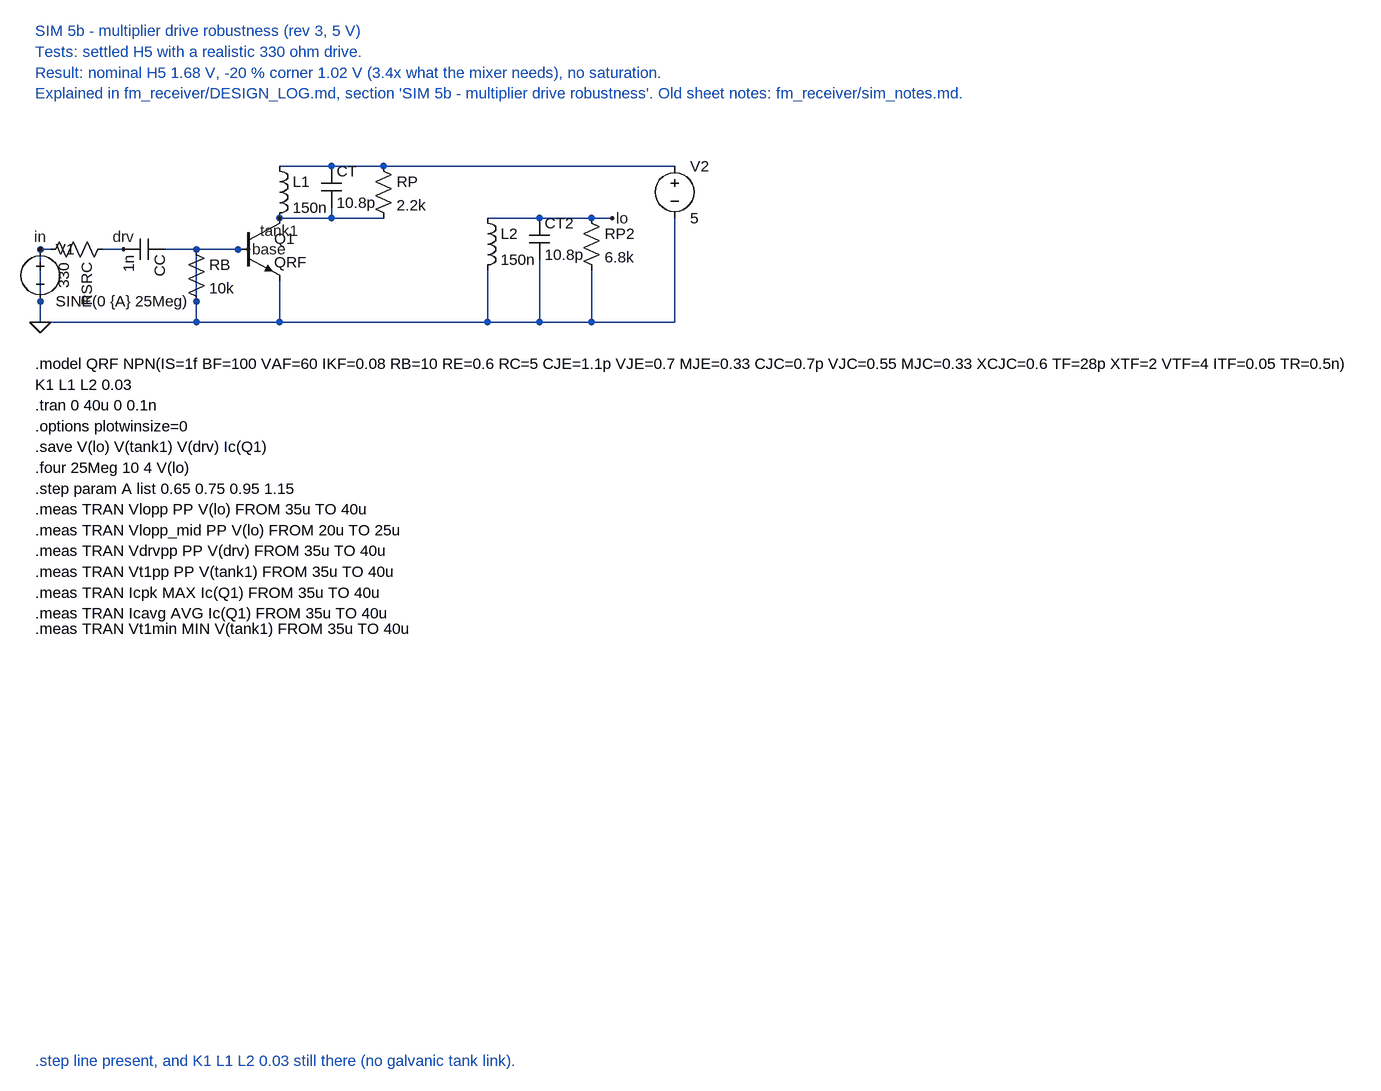
[diagram p0: schematic sim5b_multiplier_drive.asc]
sim5b_multiplier_drive.asc, the LTspice schematic file:
Version 4
SHEET 1 1400 780
WIRE 96 144 80 144
WIRE 208 144 176 144
WIRE 400 144 272 144
WIRE 320 224 320 144
WIRE 80 224 80 144
WIRE 528 16 448 16
WIRE 608 16 528 16
WIRE 1056 16 608 16
WIRE 528 96 448 96
WIRE 608 96 528 96
WIRE 528 96 528 80
WIRE 848 96 768 96
WIRE 928 96 848 96
WIRE 960 96 928 96
WIRE 448 256 448 192
WIRE 320 256 320 224
WIRE 80 256 80 224
WIRE 320 256 80 256
WIRE 448 256 320 256
WIRE 768 256 768 176
WIRE 768 256 448 256
WIRE 848 256 848 160
WIRE 848 256 768 256
WIRE 928 256 928 176
WIRE 928 256 848 256
WIRE 1056 256 928 256
WIRE 1056 256 1056 96
FLAG 80 256 0
FLAG 80 144 in
FLAG 208 144 drv
FLAG 400 144 base
FLAG 448 96 tank1
FLAG 960 96 lo
SYMBOL voltage 80 128 R0
SYMATTR InstName V1
SYMATTR Value SINE(0 {A} 25Meg)
SYMBOL res 192 128 R90
SYMATTR InstName RSRC
SYMATTR Value 330
SYMBOL cap 272 128 R90
SYMATTR InstName CC
SYMATTR Value 1n
SYMBOL res 304 128 R0
SYMATTR InstName RB
SYMATTR Value 10k
SYMBOL npn 384 96 R0
SYMATTR InstName Q1
SYMATTR Value QRF
SYMBOL ind 432 0 R0
SYMATTR InstName L1
SYMATTR Value 150n
SYMBOL cap 512 16 R0
SYMATTR InstName CT
SYMATTR Value 10.8p
SYMBOL res 592 0 R0
SYMATTR InstName RP
SYMATTR Value 2.2k
SYMBOL ind 752 80 R0
SYMATTR InstName L2
SYMATTR Value 150n
SYMBOL cap 832 96 R0
SYMATTR InstName CT2
SYMATTR Value 10.8p
SYMBOL res 912 80 R0
SYMATTR InstName RP2
SYMATTR Value 6.8k
SYMBOL voltage 1056 0 R0
SYMATTR InstName V2
SYMATTR Value 5
TEXT 72 320 Left 2 !.model QRF NPN(IS=1f BF=100 VAF=60 IKF=0.08 RB=10 RE=0.6 RC=5 CJE=1.1p VJE=0.7 MJE=0.33 CJC=0.7p VJC=0.55 MJC=0.33 XCJC=0.6 TF=28p XTF=2 VTF=4 ITF=0.05 TR=0.5n)
TEXT 72 352 Left 2 !K1 L1 L2 0.03
TEXT 72 384 Left 2 !.tran 0 40u 0 0.1n
TEXT 72 416 Left 2 !.options plotwinsize=0
TEXT 72 448 Left 2 !.save V(lo) V(tank1) V(drv) Ic(Q1)
TEXT 72 480 Left 2 !.four 25Meg 10 4 V(lo)
TEXT 72 512 Left 2 !.step param A list 0.65 0.75 0.95 1.15
TEXT 72 544 Left 2 !.meas TRAN Vlopp PP V(lo) FROM 35u TO 40u
TEXT 72 576 Left 2 !.meas TRAN Vlopp_mid PP V(lo) FROM 20u TO 25u
TEXT 72 608 Left 2 !.meas TRAN Vdrvpp PP V(drv) FROM 35u TO 40u
TEXT 72 640 Left 2 !.meas TRAN Vt1pp PP V(tank1) FROM 35u TO 40u
TEXT 72 672 Left 2 !.meas TRAN Icpk MAX Ic(Q1) FROM 35u TO 40u
TEXT 72 704 Left 2 !.meas TRAN Icavg AVG Ic(Q1) FROM 35u TO 40u
TEXT 72 728 Left 2 !.meas TRAN Vt1min MIN V(tank1) FROM 35u TO 40u
TEXT 72 1392 Left 2 ;.step line present, and K1 L1 L2 0.03 still there (no galvanic tank link).
TEXT 72 -192 Left 2 ;SIM 5b - multiplier drive robustness (rev 3, 5 V)
TEXT 72 -160 Left 2 ;Tests: settled H5 with a realistic 330 ohm drive.
TEXT 72 -128 Left 2 ;Result: nominal H5 1.68 V, -20 % corner 1.02 V (3.4x what the mixer needs), no saturation.
TEXT 72 -96 Left 2 ;Explained in fm_receiver/DESIGN_LOG.md, section 'SIM 5b - multiplier drive robustness'. Old sheet notes: fm_receiver/sim_notes.md.

The netlist it stands for:
* sim5b_multiplier_drive.asc
V1 0 0 SINE(0 {A} 25Meg)
RSRC drv 0 330
CC 0 drv 1n
RB 0 0 10k
Q1 tank1 0 0 0 QRF
L1 N001 tank1 150n
CT N001 tank1 10.8p
RP N001 tank1 2.2k
L2 lo 0 150n
CT2 lo 0 10.8p
RP2 lo 0 6.8k
V2 N001 0 5
.model NPN NPN
.model PNP PNP
.lib standard.bjt
.model QRF NPN(IS=1f BF=100 VAF=60 IKF=0.08 RB=10 RE=0.6 RC=5 CJE=1.1p VJE=0.7 MJE=0.33 CJC=0.7p VJC=0.55 MJC=0.33 XCJC=0.6 TF=28p XTF=2 VTF=4 ITF=0.05 TR=0.5n)
K1 L1 L2 0.03
.tran 0 40u 0 0.1n
.options plotwinsize=0
.save V(lo) V(tank1) V(drv) Ic(Q1)
.four 25Meg 10 4 V(lo)
.step param A list 0.65 0.75 0.95 1.15
.meas TRAN Vlopp PP V(lo) FROM 35u TO 40u
.meas TRAN Vlopp_mid PP V(lo) FROM 20u TO 25u
.meas TRAN Vdrvpp PP V(drv) FROM 35u TO 40u
.meas TRAN Vt1pp PP V(tank1) FROM 35u TO 40u
.meas TRAN Icpk MAX Ic(Q1) FROM 35u TO 40u
.meas TRAN Icavg AVG Ic(Q1) FROM 35u TO 40u
.meas TRAN Vt1min MIN V(tank1) FROM 35u TO 40u
* .step line present, and K1 L1 L2 0.03 still there (no galvanic tank link).
* SIM 5b - multiplier drive robustness (rev 3, 5 V)
* Tests: settled H5 with a realistic 330 ohm drive.
* Result: nominal H5 1.68 V, -20 % corner 1.02 V (3.4x what the mixer needs), no saturation.
* Explained in fm_receiver/DESIGN_LOG.md, section 'SIM 5b - multiplier drive robustness'. Old sheet notes: fm_receiver/sim_notes.md.
.backanno
.end